# EAGLE design xkid_0.2 (EAGLE 6.5.0)
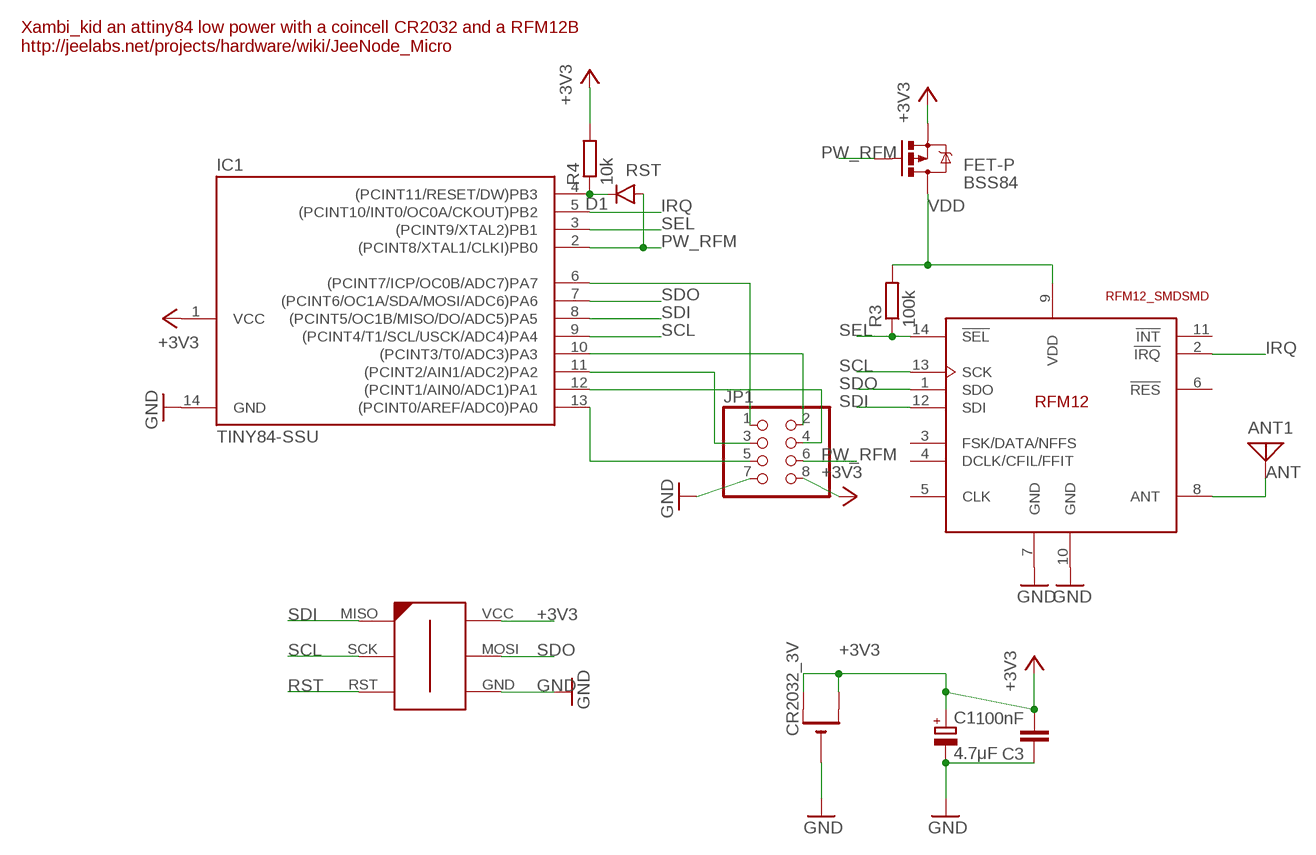
[diagram p0: schematic, sheet 1]

## Parts
ANT1  ANTENNA  [PAD-01]
BSS84  FET-P  MOSFET-PCHANNEL  [SOT23-3]
C1  4.7μF  CPOL-EUCT3216  [CT3216]
C3  100nF  C-EUC0805K  [C0805K]
CR2032_3V  CR2032THM  [CR2032-THRU]
D1  DIODESOD  [SOD-323]
IC1  TINY84-SSU  TINY24/44/84-SSU  [SOIC14]
JP1  PINHD-2X4_2.54  [2X04]
R3  100k  R-EU_R0805  [R0805]
R4  10k  R-EU_R0805  [R0805]
U$1  RFM12_SMDSMD  [RFM12]
U$2  AVR-ISP-6-EDGE  [6PAD_ISP]

## Nets
+3V3: BSS84.2(S) C1.+ C3.2 CR2032_3V.+1(+) CR2032_3V.+2(+1) IC1.1(VCC) JP1.8 R4.2 U$2.VCC
ANT: ANT1.1 U$1.8(ANT)
GND: C1.- C3.1 CR2032_3V.- IC1.14(GND) JP1.7 U$1.7(GND) U$1.10(GND) U$2.GND
IRQ: IC1.5((PCINT10/INT0/OC0A/CKOUT)PB2) U$1.2(!IRQ)
PA0: IC1.13((PCINT0/AREF/ADC0)PA0) JP1.5
PA1: IC1.12((PCINT1/AIN0/ADC1)PA1) JP1.4
PA2: IC1.11((PCINT2/AIN1/ADC2)PA2) JP1.3
PA3: IC1.10((PCINT3/T0/ADC3)PA3) JP1.2
PA7: IC1.6((PCINT7/ICP/OC0B/ADC7)PA7) JP1.1
PW_RFM: BSS84.1(G) D1.A IC1.2((PCINT8/XTAL1/CLKI)PB0) JP1.6
RST: D1.C IC1.4((PCINT11/RESET/DW)PB3) R4.1 U$2.RST
SCL: IC1.9((PCINT4/T1/SCL/USCK/ADC4)PA4) U$1.13(SCK) U$2.SCK
SDI: IC1.8((PCINT5/OC1B/MISO/DO/ADC5)PA5) U$1.12(SDI) U$2.MISO
SDO: IC1.7((PCINT6/OC1A/SDA/MOSI/ADC6)PA6) U$1.1(SDO) U$2.MOSI
SEL: IC1.3((PCINT9/XTAL2)PB1) R3.1 U$1.14(!SEL)
VDD: BSS84.3(D) R3.2 U$1.9(VDD)
Unconnected: U$1.3(FSK/DATA/NFFS) U$1.4(DCLK/CFIL/FFIT) U$1.5(CLK) U$1.6(!RES) U$1.11(!INT)

## Notes on the sheet
- Xambi_kid an attiny84 low power with a coincell CR2032 and a RFM12B
  http://jeelabs.net/projects/hardware/wiki/JeeNode_Micro

## Library data of the parts
ANT1 = discrete:ANTENNA: Antenna
BSS84 = SparkFun-DiscreteSemi:MOSFET-PCHANNEL: Generic PMOSFET IRLML2244 - TRANS-11153 (SOT-23 -20V -4.3A) (1.Gate 2.Source 3.Drain) FQP27P06 - COM-10349 <http://www.sparkfun.com/products/10349> (TO-220 -60V -27A) (1.Gate 2.Source 3.Drain); PROD_ID: TRANS-08285
C1 = rcl:CPOL-EU: POLARIZED CAPACITOR, European symbol
C3 = rcl:C-EU: CAPACITOR, European symbol
CR2032_3V = _adafruit:CR2032
D1 = SparkFun-DiscreteSemi:DIODE: Diode These are standard reverse protection diodes and small signal diodes. SMA package can handle up to about 1A. SOD-323 can handle about 200mA. What the SOD-323 package when ordering, there are some mfgs out there that are 5-pin packages.; PROD_ID: DIO-09646
IC1 = avr-7:TINY24/44/84
JP1 = pinhead:PINHD-2X4: PIN HEADER
R3 R4 = rcl:R-EU_: RESISTOR, European symbol
U$1 = rfm_12:RFM12_SMD: RFM12 is a low costing ISM band transceiver module implemented with unique PLL. It works signal ranges from 315/433/868/915MHZ bands, comply with FCC, ETSI regulation. The SPI interface is used to communicate with microcontroller for parameter setting.
U$2 = avr-7:AVR-ISP-6-EDGE: 6 pin edge connector for ISP with ATMEL MCUs. Developed by Craig Moates (craig at moates dot net). Library by David Blundell (blundar at gmail dot com). Often, even a 6 pin header is really inconvenient for board layout and/or production. This SMD-only header is our de-facto standard for using an edge connector for programming with the help of a 6pin/10pin to edge card adapter.

## Net classes
0 default: width 0.203 mm, clearance 0.152 mm

## Board
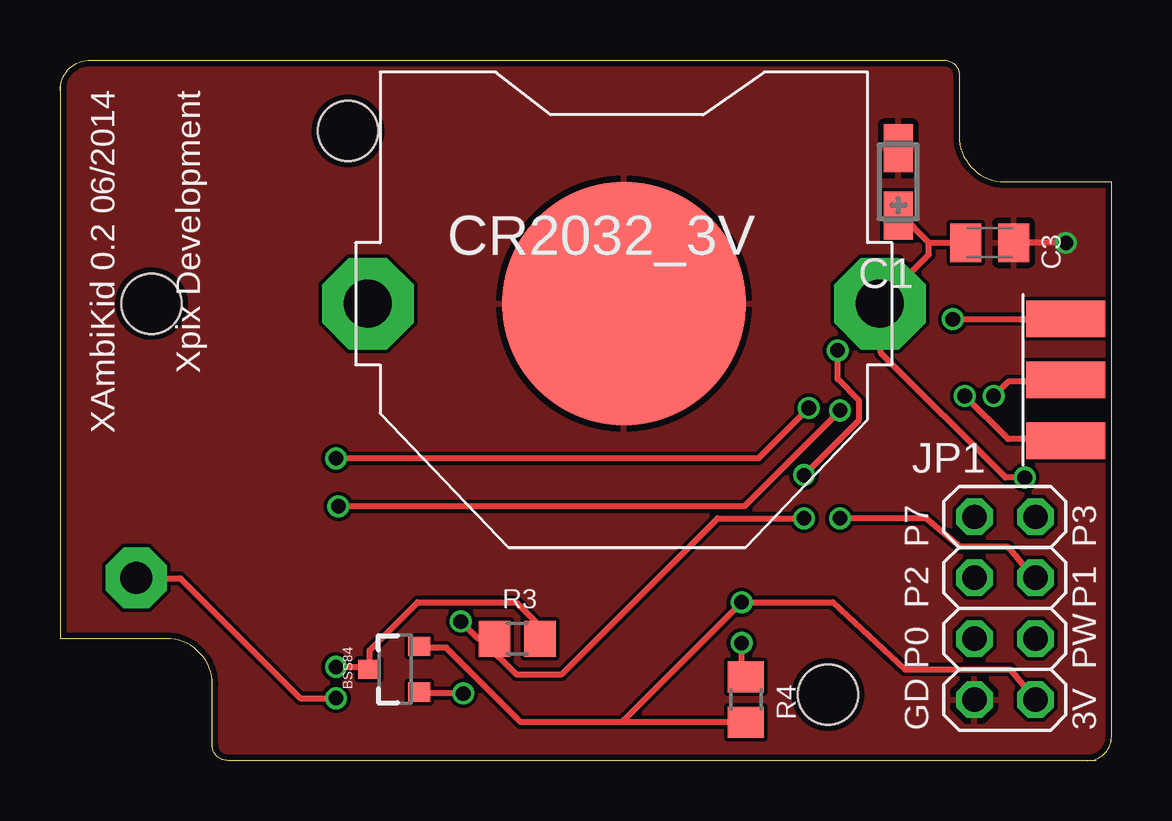
[diagram p1: board, top side]
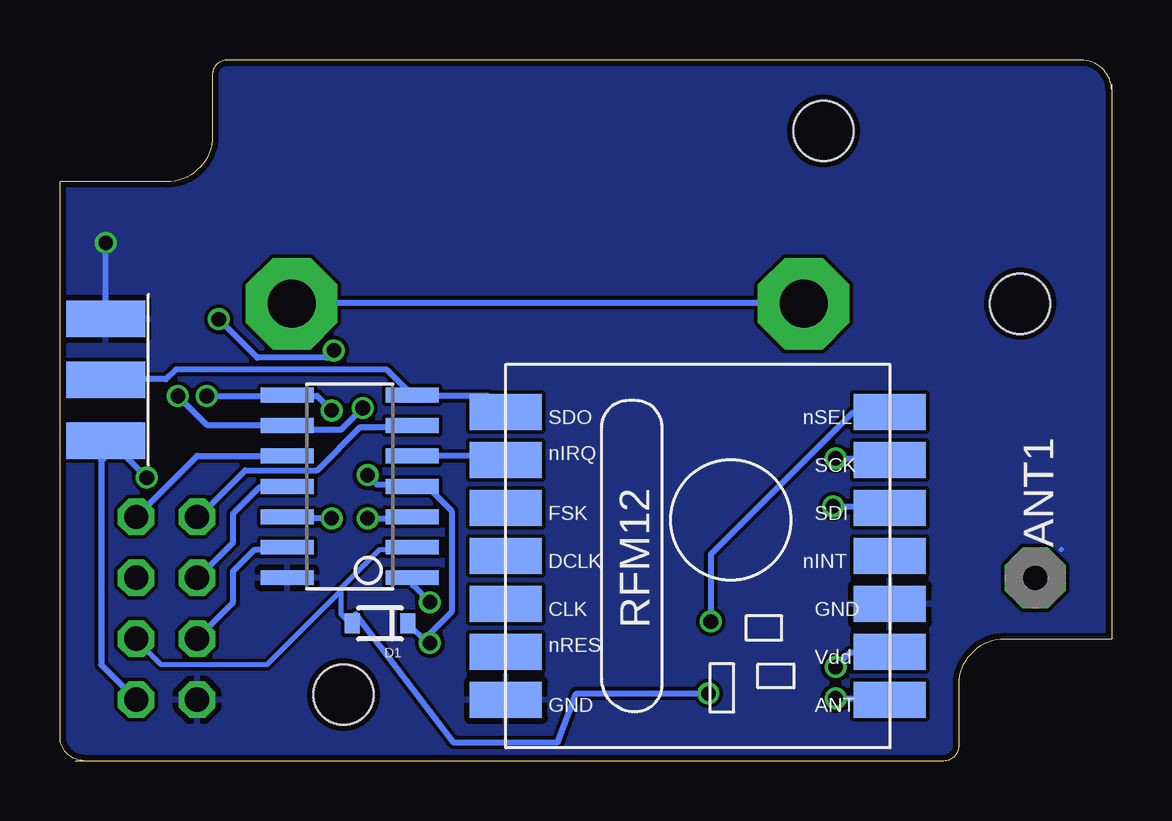
[diagram p2: board, bottom side, seen from below]

Size 43.81 x 29.21 mm. Coordinates in mm from the lower left corner, seen from the top.
Outline: 42.81,0 arc90 43.81,1 43.81,24.13 39.37,24.13 arc-90 37.47,26.04 37.47,28.57 arc90 36.83,29.21 1.27,29.21 arc90 0,27.94
Outline: 0,28.21 0,5.08 4.45,5.08 arc-90 6.35,3.17 6.35,0.64 arc90 6.99,0 43.18,0
Copper layers (1*16): Top 0.035mm / dielectric 1.5mm / Bottom 0.035mm
Design rules "ITEADstudio_DRC": minimum track width 6mil, minimum drill 12mil, track to track 6mil, track to pad 6mil, pad to pad 6mil, via to via 6mil, smd to smd 0mil, copper to edge 10mil, drill to drill 10mil, minimum pad ring 10mil, minimum via ring 6mil, stop-mask expansion 2mil, vias tented up to drill 100mil, thermal gap 10mil
Holes 2.5 mm at 32,2.75 12,26.25 3.81,19.05

### Footprints (pad centres in the part's own frame; a part is rotated, then mirrored left to right if it is on the bottom)
PAD-01 = drill 1.321 pad 2.54 octagon: 1 0,0
SOT23-3 = smd 0.8 x 0.9: 1 -0.95,-1; 2 0.95,-1; 3 0,1.1
CT3216 = smd 2 x 1.2: + -1.4,0; - 1.4,0
C0805K = smd 1.3 x 1.6: 1 -1,0; 2 1,0
CR2032-THRU = drill 2 pad 3.81 octagon: +1 -10.668,0; +2 10.668,0 | smd 10.16 x 10.16: - 0,0
SOD-323 = smd 0.63 x 0.83: A 1.15,0; C -1.15,0
SOIC14 = smd 0.61 x 2.21: 1 -3.81,-2.603; 2 -2.54,-2.603; 3 -1.27,-2.603; 4 0,-2.603; 5 1.27,-2.603; 6 2.54,-2.603; 7 3.81,-2.603; 8 3.81,2.603; 9 2.54,2.603; 10 1.27,2.603; 11 0,2.603; 12 -1.27,2.603; 13 -2.54,2.603; 14 -3.81,2.603
2X04 = drill 1.016 octagon: 1 -3.81,-1.27; 2 -3.81,1.27; 3 -1.27,-1.27; 4 -1.27,1.27; 5 1.27,-1.27; 6 1.27,1.27; 7 3.81,-1.27; 8 3.81,1.27
R0805 = smd 1.3 x 1.5: 1 -0.95,0; 2 0.95,0
RFM12 = smd 1.5 x 3: 1 -5,-10; 2 -3,-10; 3 -1,-10; 4 1,-10; 5 3,-10; 6 5,-10; 7 7,-10; 8 7,6; 9 5,6; 10 3,6; 11 1,6; 12 -1,6; 13 -3,6; 14 -5,6
6PAD_ISP = smd 1.524 x 3.302 bottom: GND 2.54,0; MOSI 0,0; VCC -2.54,0 | smd 1.524 x 3.302: MISO -2.54,0; RST 2.54,0; SCK 0,0

### Placement (x,y rotation side)
ANT1  3.17,7.62 270 bottom
BSS84  13.97,3.81 90 top
C1  34.92,24.13 90 top
C3  38.73,21.59 180 top
CR2032_3V  23.5,19.05 0 top
D1  30.48,5.71 180 bottom
IC1  31.75,11.43 90 bottom
JP1  39.37,6.35 270 top
R3  19.05,5.08 0 top
R4  28.57,2.54 270 top
U$1  15.24,9.53 270 bottom
U$2  41.91,15.88 90 top

### Tracks (layer width: path | path; a pad name or v marks a point on that pad's centre or on a via)
+3V3  (via drill 0.61)
  Top 0.254: 36.2,21.6 37.7,21.6 C3.2 | 36.2,21.6 35,22.8 C1.+ | 36.2,21.6 36.2,21.1 34.2,19.1 CR2032_3V.+2 34.2,19 34.2,17 39.4,11.8 v40.2,11.8 | 23.5,1.6 28.5,1.6 R4.2 | 23.5,1.6 19.2,1.6 16.1,4.7 15,4.7 BSS84.2 | 23.5,1.6 23.5,1.7 v28.4,6.6 32.2,6.6 35.2,3.8 39.6,3.8 40.6,2.6 JP1.8
  Bottom 0.254: CR2032_3V.+1 12.9,19.1 34.1,19.1 CR2032_3V.+2 | JP1.8 42.1,4 42.1,12.5 41.5,13.1 | 41.5,13.1 41.3,13.3 U$2.VCC 41.5,13.1 | v28.4,6.6 29.1,7.3 29.1,7.6 IC1.1 | 41.5,13.1 v40.2,11.8
ANT  (via drill 0.61)
  Top 0.254: v11.5,2.6 10,2.6 5,7.6 3.2,7.6 ANT1.1
  Bottom 0.254: v11.5,2.6 9.3,2.6 U$1.8
GND  (via drill 0.6)
  Top 0.254: v41.91,21.59 C3.1
  Bottom 0.203: 2.1,8.8
  Bottom 0.254: U$2.GND v41.91,21.59
  pour Bottom: 0,0 0,29.21 44.45,29.21 44.45,0
  pour Top: 0,0 0,29.21 44.45,29.21 44.45,0
IRQ
  Bottom 0.254: IC1.5 25.4,12.7 25.3,12.6 U$1.2
PA0
  Bottom 0.254: IC1.13 34.4,8.8 35.7,8.8 36.6,7.9 36.6,6.6 38.1,5.1 JP1.5
PA1  (via drill 0.61)
  Top 0.254: v32.5,10.1 36.1,10.1 37.5,8.9 39.5,8.9 40.6,7.6 JP1.4
  Bottom 0.254: v32.5,10.1 34.3,10.1 IC1.12
PA2
  Bottom 0.254: IC1.11 34.4,11.4 35.5,11.4 36.6,10.3 36.6,9.1 38.1,7.6 JP1.3
PA3
  Bottom 0.254: IC1.10 38.1,12.7 JP1.2
PA7
  Bottom 0.254: IC1.6 29.2,13.9 31.3,13.9 33.1,12.1 36.1,12.1 38.1,10.1 JP1.1
PW_RFM  (via drill 0.61)
  Top 0.254: v16.8,2.8 15,2.8 BSS84.1
  Bottom 0.203: 32.1,7 32.1,6.1 31.7,5.7 D1.A | 32.1,7 32.1,7.2 30.5,8.8 29.2,8.8 IC1.2 | JP1.6 40.6,5 39.6,4 35.2,4 32.2,7 32.1,7
  Bottom 0.254: v16.8,2.8 22.3,2.8 23.07,0.77 27.43,0.77 31.5,6.1 D1.A
RST  (via drill 0.61)
  Top 0.254: v28.4,4.9 28.4,3.6 28.5,3.5 R4.1 | v37.2,18.4 41.2,18.4 U$2.RST | v32.4,17.1 32.4,15.9 33.3,15 33.3,14.2 v31,11.9
  Bottom 0.254: D1.C 29.3,5.7 28.5,4.9 v28.4,4.9 28.6,5.1 27.5,6.2 27.5,10.4 28.5,11.4 29.1,11.4 IC1.4 29.2,11.5 30.6,11.5 v31,11.9 | v37.2,18.4 35.6,16.8 32.7,16.8 v32.4,17.1
SCL  (via drill 0.61)
  Top 0.254: v38.9,15.2 39.5,15.8 41.2,15.8 U$2.SCK | v11.5,12.6 29.1,12.6 v31.2,14.7
  Bottom 0.254: v38.9,15.2 37.7,14 34.4,14 IC1.9 34.3,13.9 34.2,13.8 32.1,13.8 v31.2,14.7 | v11.5,12.6 9.3,12.6 U$1.13
SDI  (via drill 0.61)
  Top 0.254: v37.7,15.2 39.5,13.4 41.2,13.4 U$2.MISO | v11.6,10.6 28.5,10.6 v32.5,14.6
  Bottom 0.254: v37.7,15.2 34.4,15.2 IC1.8 34.3,15.2 33.1,15.2 v32.5,14.6 | v11.6,10.6 9.3,10.6 U$1.12
SDO
  Bottom 0.254: U$1.1 25.3,14.5 26,15.2 29.1,15.2 IC1.7 29.2,15.3 30.2,16.3 39,16.3 39.4,15.9 41.2,15.9 U$2.MOSI
SEL  (via drill 0.61)
  Top 0.254: v16.7,5.8 17.4,5.1 18.1,5.1 R3.1 17.6,5 19,3.6 20.9,3.6 27.4,10.1 v31,10.1
  Bottom 0.254: v16.7,5.8 16.7,8.6 10.8,14.5 9.3,14.5 U$1.14 | v31,10.1 29.2,10.1 IC1.3
VDD  (via drill 0.61)
  Top 0.254: v11.5,3.9 12.8,3.9 BSS84.3 12.9,3.9 12.9,4.6 14.9,6.6 19,6.6 20,5.6 R3.2
  Bottom 0.254: v11.5,3.9 10.9,4.5 9.3,4.5 U$1.9

### Text on the board
tNames: XAmbiKid 0.2 06/2014 / Xpix Development | P7 | P3 | P2 | P1 | P0 | PW | GD | 3V